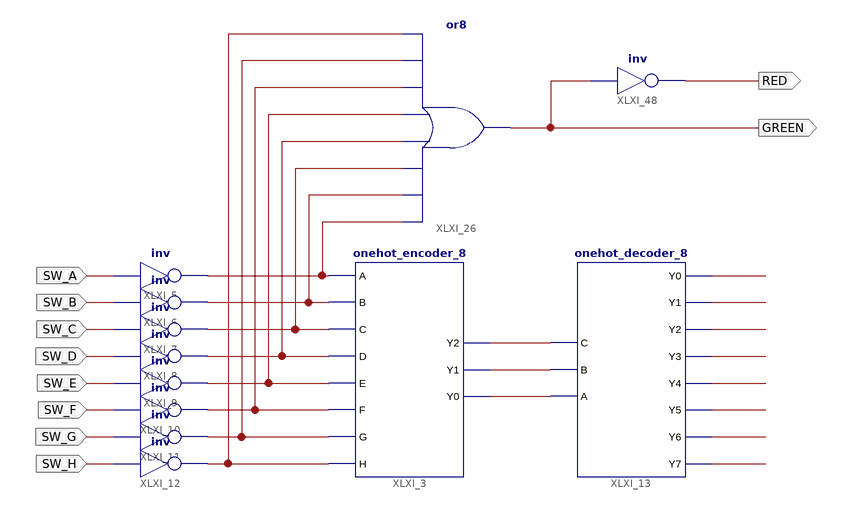
[diagram p0: schematic sheet 1]
// Xilinx ISE schematic top_level.sch (zynq) as structural Verilog: 12 symbols, 10 ports
module top_level (
  input  SW_A,
  input  SW_B,
  input  SW_C,
  input  SW_D,
  input  SW_E,
  input  SW_F,
  input  SW_G,
  input  SW_H,
  output GREEN,
  output RED
);

  wire XLXN_34, XLXN_35, XLXN_36, XLXN_37, XLXN_124, XLXN_125, XLXN_126, XLXN_127, XLXN_128, XLXN_129,
       XLXN_130, Y0, Y1, Y2, Y3, Y4, Y5, Y6, Y7;

  or XLXI_26 (GREEN, XLXN_34, XLXN_35, XLXN_36, XLXN_37, XLXN_124, XLXN_125, XLXN_126, XLXN_127);
  not XLXI_5 (XLXN_34, SW_A);
  not XLXI_6 (XLXN_35, SW_B);
  not XLXI_7 (XLXN_36, SW_C);
  not XLXI_8 (XLXN_37, SW_D);
  not XLXI_10 (XLXN_125, SW_F);
  not XLXI_11 (XLXN_126, SW_G);
  not XLXI_12 (XLXN_127, SW_H);
  not XLXI_9 (XLXN_124, SW_E);
  onehot_encoder_8 XLXI_3 (
    .E(XLXN_124), .F(XLXN_125), .G(XLXN_126), .H(XLXN_127), .Y1(XLXN_129), .Y0(XLXN_130), .Y2(XLXN_128),
    .D(XLXN_37), .A(XLXN_34), .B(XLXN_35), .C(XLXN_36));
  onehot_decoder_8 XLXI_13 (
    .B(XLXN_129), .Y0(Y0), .Y1(Y1), .Y2(Y2), .Y3(Y3), .Y4(Y4), .Y5(Y5), .Y6(Y6), .Y7(Y7), .A(XLXN_130),
    .C(XLXN_128));
  not XLXI_48 (RED, GREEN);
endmodule
